# EAGLE schematic PCB-DISPARRAY4a (EAGLE 6.5.0)

## Sheet 1 of 2
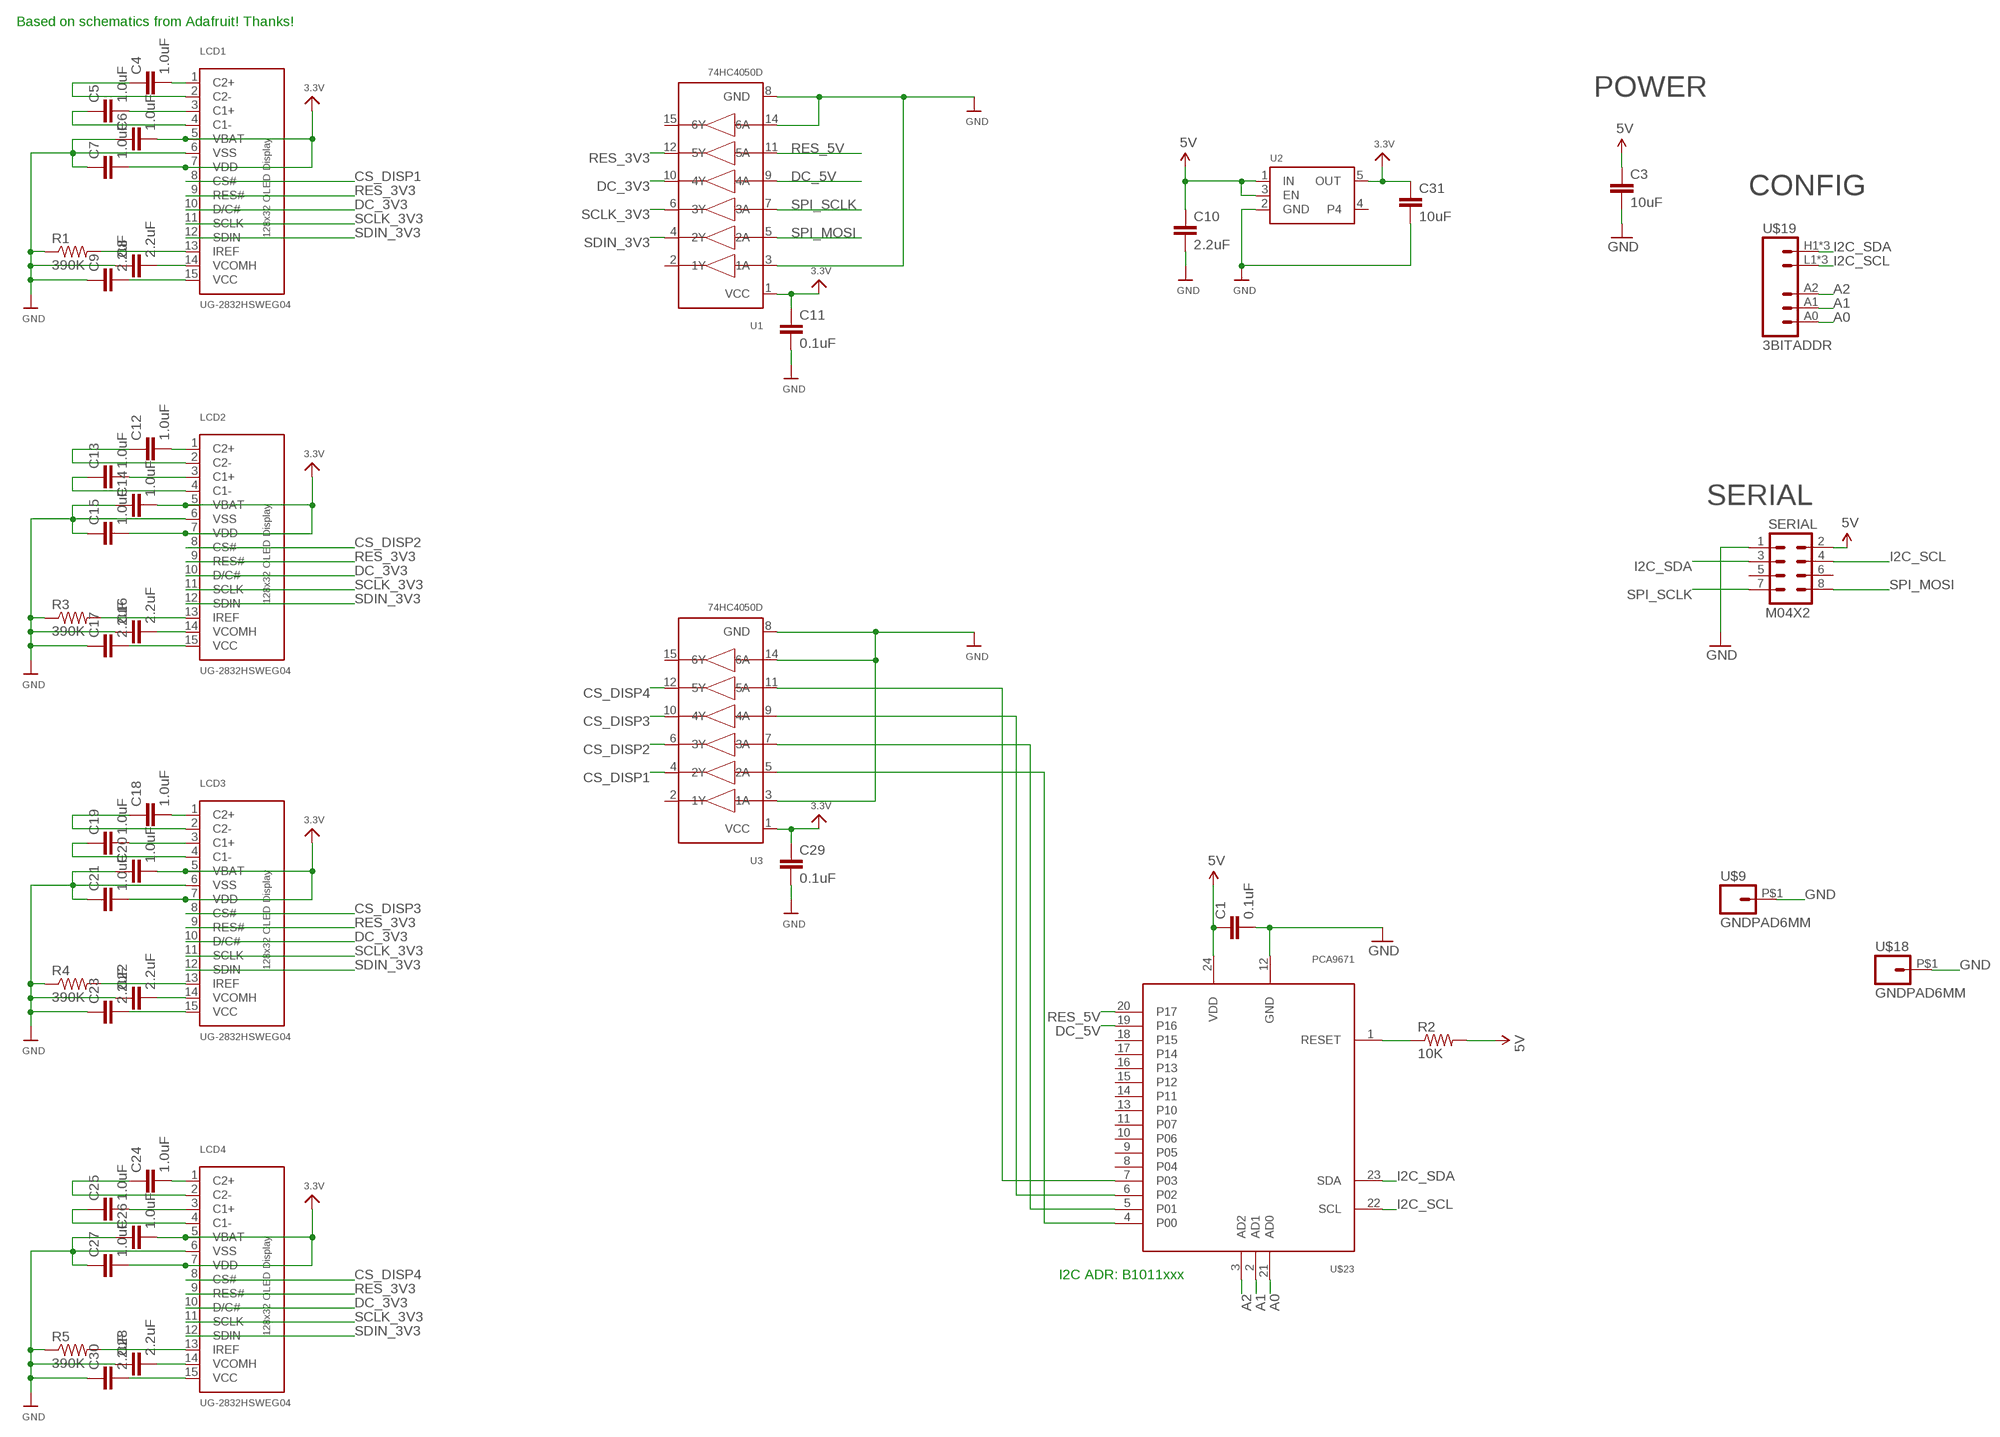
[diagram p0: schematic, sheet 1]

### Parts
C1  0.1uF  CAP0603-CAP  [0603-CAP]
C3  10uF  CAP0805  [0805]
C4  1.0uF  CAP0603-CAP  [0603-CAP]
C5  1.0uF  CAP0603-CAP  [0603-CAP]
C6  1.0uF  CAP0603-CAP  [0603-CAP]
C7  1.0uF  CAP0603-CAP  [0603-CAP]
C8  2.2uF  CAP0603-CAP  [0603-CAP]
C9  2.2uF  CAP0603-CAP  [0603-CAP]
C10  2.2uF  CAP0805  [0805]
C11  0.1uF  CAP0603-CAP  [0603-CAP]
C12  1.0uF  CAP0603-CAP  [0603-CAP]
C13  1.0uF  CAP0603-CAP  [0603-CAP]
C14  1.0uF  CAP0603-CAP  [0603-CAP]
C15  1.0uF  CAP0603-CAP  [0603-CAP]
C16  2.2uF  CAP0603-CAP  [0603-CAP]
C17  2.2uF  CAP0603-CAP  [0603-CAP]
C18  1.0uF  CAP0603-CAP  [0603-CAP]
C19  1.0uF  CAP0603-CAP  [0603-CAP]
C20  1.0uF  CAP0603-CAP  [0603-CAP]
C21  1.0uF  CAP0603-CAP  [0603-CAP]
C22  2.2uF  CAP0603-CAP  [0603-CAP]
C23  2.2uF  CAP0603-CAP  [0603-CAP]
C24  1.0uF  CAP0603-CAP  [0603-CAP]
C25  1.0uF  CAP0603-CAP  [0603-CAP]
C26  1.0uF  CAP0603-CAP  [0603-CAP]
C27  1.0uF  CAP0603-CAP  [0603-CAP]
C28  2.2uF  CAP0603-CAP  [0603-CAP]
C29  0.1uF  CAP0603-CAP  [0603-CAP]
C30  2.2uF  CAP0603-CAP  [0603-CAP]
C31  10uF  CAP0805  [0805]
LCD1  UG-2832HSWEG04  OLED_UG-2832HSWEG04WRAPAROUND  [UG-2832HSWEG04_WRAPAROUND]
LCD2  UG-2832HSWEG04  OLED_UG-2832HSWEG04WRAPAROUND  [UG-2832HSWEG04_WRAPAROUND]
LCD3  UG-2832HSWEG04  OLED_UG-2832HSWEG04WRAPAROUND  [UG-2832HSWEG04_WRAPAROUND]
LCD4  UG-2832HSWEG04  OLED_UG-2832HSWEG04WRAPAROUND  [UG-2832HSWEG04_WRAPAROUND]
R1  390K  RESISTOR0603-RES  [0603-RES]
R2  10K  RESISTOR0603-RES  [0603-RES]
R3  390K  RESISTOR0603-RES  [0603-RES]
R4  390K  RESISTOR0603-RES  [0603-RES]
R5  390K  RESISTOR0603-RES  [0603-RES]
SERIAL  M04X2  [2X4]
U1  74HC4050D  74HC4050DTSSOP16  [TSSOP16]
U2  VREG_SOT23-5  [SOT23-5]
U3  74HC4050D  74HC4050DTSSOP16  [TSSOP16]
U$9  GNDPAD6MM  [3.2MMPAD6MM]
U$18  GNDPAD6MM  [3.2MMPAD6MM]
U$19  3BITADDR  [3BITADDR]
U$23  PCA9671  [TSSOP24]

### Nets
3.3V [Power]: C6.2 C7.2 C11.1 C14.2 C15.2 C20.2 C21.2 C26.2 C27.2 C29.1 C31.1 LCD1.5(VBAT) LCD1.7(VDD) LCD2.5(VBAT) LCD2.7(VDD) LCD3.5(VBAT) LCD3.7(VDD) LCD4.5(VBAT) LCD4.7(VDD) U1.1(VCC) U2.5(OUT) U3.1(VCC)
5V [Power]: C1.1 C3.1 C10.1 R2.2 SERIAL.2 U2.1(IN) U2.3(EN) U$23.24(VDD)
A0: U$19.A0 U$23.21(AD0)
A1: U$19.A1 U$23.2(AD1)
A2: U$19.A2 U$23.3(AD2)
CS_DISP1: LCD1.8(CS#) U3.4(2Y)
CS_DISP2: LCD2.8(CS#) U3.6(3Y)
CS_DISP3: LCD3.8(CS#) U3.10(4Y)
CS_DISP4: LCD4.8(CS#) U3.12(5Y)
DC_3V3: LCD1.10(D/C#) LCD2.10(D/C#) LCD3.10(D/C#) LCD4.10(D/C#) U1.10(4Y)
DC_5V: U1.9(4A) U$23.19(P16)
GND [Power]: C1.2 C3.2 C6.1 C7.1 C8.1 C9.1 C10.2 C11.2 C14.1 C15.1 C16.1 C17.1 C20.1 C21.1 C22.1 C23.1 C26.1 C27.1 C28.1 C29.2 C30.1 C31.2 LCD1.6(VSS) LCD2.6(VSS) LCD3.6(VSS) LCD4.6(VSS) R1.1 R3.1 R4.1 R5.1 SERIAL.1 U1.3(1A) U1.8(GND) U1.14(6A) U2.2(GND) U3.3(1A) U3.8(GND) U3.14(6A) U$9.P$1 U$18.P$1 U$23.12(GND)
I2C_SCL: SERIAL.4 U$19.L1(GND) U$19.L2(GND) U$19.L3(GND) U$23.22(SCL)
I2C_SDA: SERIAL.3 U$19.H1(VCC) U$19.H2(VCC) U$19.H3(VCC) U$23.23(SDA)
N$1: R2.1 U$23.1(RESET)
N$2: C4.1 LCD1.2(C2-)
N$3: C4.2 LCD1.1(C2+)
N$4: C5.1 LCD1.4(C1-)
N$5: C12.1 LCD2.2(C2-)
N$6: C12.2 LCD2.1(C2+)
N$7: C5.2 LCD1.3(C1+)
N$8: LCD1.13(IREF) R1.2
N$9: C8.2 LCD1.14(VCOMH)
N$10: C13.1 LCD2.4(C1-)
N$11: C13.2 LCD2.3(C1+)
N$12: LCD2.13(IREF) R3.2
N$13: C16.2 LCD2.14(VCOMH)
N$14: C17.2 LCD2.15(VCC)
N$15: C18.1 LCD3.2(C2-)
N$16: C18.2 LCD3.1(C2+)
N$17: C19.1 LCD3.4(C1-)
N$18: C19.2 LCD3.3(C1+)
N$19: LCD3.13(IREF) R4.2
N$20: C22.2 LCD3.14(VCOMH)
N$21: C23.2 LCD3.15(VCC)
N$22: C24.1 LCD4.2(C2-)
N$23: C24.2 LCD4.1(C2+)
N$24: C25.1 LCD4.4(C1-)
N$25: C25.2 LCD4.3(C1+)
N$26: LCD4.13(IREF) R5.2
N$27: C28.2 LCD4.14(VCOMH)
N$28: C9.2 LCD1.15(VCC)
N$29: U3.5(2A) U$23.4(P00)
N$30: U3.7(3A) U$23.5(P01)
N$31: U3.9(4A) U$23.6(P02)
N$32: U3.11(5A) U$23.7(P03)
N$33: C30.2 LCD4.15(VCC)
RES_3V3: LCD1.9(RES#) LCD2.9(RES#) LCD3.9(RES#) LCD4.9(RES#) U1.12(5Y)
RES_5V: U1.11(5A) U$23.20(P17)
SCLK_3V3: LCD1.11(SCLK) LCD2.11(SCLK) LCD3.11(SCLK) LCD4.11(SCLK) U1.6(3Y)
SDIN_3V3: LCD1.12(SDIN) LCD2.12(SDIN) LCD3.12(SDIN) LCD4.12(SDIN) U1.4(2Y)
SPI_MOSI: SERIAL.8 U1.5(2A)
SPI_SCLK: SERIAL.7 U1.7(3A)
Unconnected: SERIAL.5 SERIAL.6 U1.2(1Y) U1.15(6Y) U2.4 U3.2(1Y) U3.15(6Y) U$23.8(P04) U$23.9(P05) U$23.10(P06) U$23.11(P07) U$23.13(P10) U$23.14(P11) U$23.15(P12) U$23.16(P13) U$23.17(P14) U$23.18(P15)

### Notes on the sheet
- Based on schematics from Adafruit! Thanks!
- POWER
- CONFIG
- SERIAL
- I2C ADR: B1011xxx

## Sheet 2 of 2

## Library data of the parts
C1 C3-C31 = SparkFun:CAP: Capacitor Standard 0603 ceramic capacitor, and 0.1" leaded capacitor.
LCD1-LCD4 = microbuilder:OLED_UG-2832HSWEG04: 128x32 SPI 0.91" Monochrome OLED Display
R1-R5 = SparkFun:RESISTOR: Resistor Basic schematic elements and footprints for 0603, 1206, and PTH resistors.
SERIAL = SparkFun:M04X2
U1 U3 = SKAARHOJ:74HC4050D: 6-channel level shifter 74HC4050D - 2V-6V Supply Digikey: 74HC4050D,653-ND Mouser: 771-74HC4050D-T
U2 = microbuilder:VREG_SOT23-5: SOT23-5 Fixed Voltage Regulators To better organise some of the SOT23-5 fixed voltage regulators in this library, this new part was created. Part Current Out V Out V In V Dropout Digikey Part No. ADP121 150mA 3.3V 3.4-5.5V 0.09V @ 150mA ADP121-AUJZ33R7CT-ND ADP121 150mA 3.0V 3.1-5.5V 0.09V @ 150mA ADP121-AUJZ30R7CT-ND ADP122 300mA 3.3V 3.4-5.5V 0.085V @ 300mA ADP122AUJZ-3.3-R7CT-ND ADP1712 300mA 3.3V 3.5-5.5V 0.17V @ 300mA ADP1712AUJZ-3.3-R7TR-ND AP7311 (Low Cost) 150mA 3.3V 3.5-6V 0.15V @ 150mA AP7311-33WG-7DICT-ND LD39015M18R 150mA 1.8V 1.9V-5.5V 0.08V @ 100mA 497-6977-1-ND MCP1824T-3302E/OT 300mA 3.3V 3.5V-6V 0.2V @ 300mA MCP1824T-3302E/OTCT-ND MIC5205-2.5YM5 TR 150mA 2.5V 2.7-16V 0.165V @ 150mA 576-1257-2-ND MIC5205-3.0YM5 TR 150mA 3.0V 3.2V-16V 0.165V @ 150mA 576-1258-2-ND MIC5205-3.3YM5 TR 150mA 3.3V 3.5V-16V 0.165V @ 150mA 576-1259-2-ND TPS780330220 150mA 3.3V+2.2V 3.6-5.5V 250mV Max 296-23332-1-ND TDA3663/N1,135 100mA 3.3V 3.5-45V 0.18V @ 50mA 568-5343-1-ND
U$9 U$18 = SKAARHOJ:GNDPAD
U$19 = SKAARHOJ:3BITADDR
U$23 = SKAARHOJ:PCA9671

## Net classes
0 default: width 0.203 mm, drill 0.406 mm, clearance 0.152 mm
1 Power: width 0.406 mm, drill 0.61 mm, clearance 0.203 mm